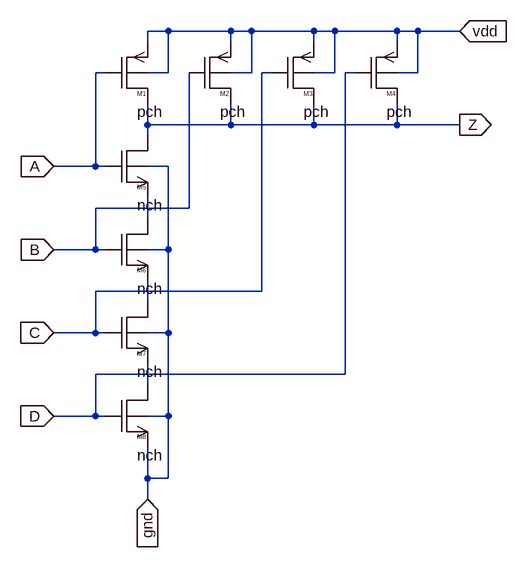
[diagram p0: schematic mynand4.asc]
mynand4.asc, the LTspice schematic file:
Version 4
SHEET 1 880 680
WIRE 128 -240 96 -240
WIRE 224 -240 128 -240
WIRE 256 -240 224 -240
WIRE 352 -240 256 -240
WIRE 384 -240 352 -240
WIRE 480 -240 384 -240
WIRE 512 -240 480 -240
WIRE 576 -240 512 -240
WIRE 96 -224 96 -240
WIRE 224 -224 224 -240
WIRE 352 -224 352 -240
WIRE 480 -224 480 -240
WIRE 32 -176 16 -176
WIRE 128 -176 128 -240
WIRE 128 -176 96 -176
WIRE 256 -176 256 -240
WIRE 256 -176 224 -176
WIRE 288 -176 272 -176
WIRE 384 -176 384 -240
WIRE 384 -176 352 -176
WIRE 416 -176 400 -176
WIRE 512 -176 512 -240
WIRE 512 -176 480 -176
WIRE 96 -96 96 -128
WIRE 224 -96 224 -128
WIRE 224 -96 96 -96
WIRE 352 -96 352 -128
WIRE 352 -96 224 -96
WIRE 480 -96 480 -128
WIRE 480 -96 352 -96
WIRE 576 -96 480 -96
WIRE 96 -80 96 -96
WIRE 16 -32 16 -176
WIRE 16 -32 -48 -32
WIRE 32 -32 16 -32
WIRE 128 -32 96 -32
WIRE 160 32 160 -176
WIRE 160 32 16 32
WIRE 96 48 96 16
WIRE 16 96 16 32
WIRE 16 96 -48 96
WIRE 32 96 16 96
WIRE 128 96 128 -32
WIRE 128 96 96 96
WIRE 272 160 272 -176
WIRE 272 160 16 160
WIRE 96 176 96 144
WIRE 16 224 16 160
WIRE 16 224 -48 224
WIRE 32 224 16 224
WIRE 128 224 128 96
WIRE 128 224 96 224
WIRE 400 288 400 -176
WIRE 400 288 16 288
WIRE 96 304 96 272
WIRE 16 352 16 288
WIRE 16 352 -48 352
WIRE 32 352 16 352
WIRE 128 352 128 224
WIRE 128 352 96 352
WIRE 96 448 96 400
WIRE 128 448 128 352
WIRE 128 448 96 448
WIRE 96 480 96 448
FLAG -48 -32 A
IOPIN -48 -32 In
FLAG -48 96 B
IOPIN -48 96 In
FLAG -48 224 C
IOPIN -48 224 In
FLAG -48 352 D
IOPIN -48 352 In
FLAG 576 -96 Z
IOPIN 576 -96 Out
FLAG 96 480 gnd
IOPIN 96 480 In
FLAG 576 -240 vdd
IOPIN 576 -240 In
SYMBOL pmos4 32 -176 R0
WINDOW 3 48 60 Left 2
SYMATTR InstName M1
SYMATTR Value pch
SYMATTR Value2 l=2u w=18u
SYMBOL pmos4 160 -176 R0
WINDOW 3 48 60 Left 2
SYMATTR InstName M2
SYMATTR Value pch
SYMATTR Value2 l=2u w=18u
SYMBOL pmos4 288 -176 R0
WINDOW 3 48 60 Left 2
SYMATTR InstName M3
SYMATTR Value pch
SYMATTR Value2 l=2u w=18u
SYMBOL pmos4 416 -176 R0
WINDOW 3 48 60 Left 2
SYMATTR InstName M4
SYMATTR Value pch
SYMATTR Value2 l=2u w=18u
SYMBOL nmos4 32 -32 R0
WINDOW 3 48 60 Left 2
SYMATTR InstName M5
SYMATTR Value nch
SYMATTR Value2 l=2u w=6u
SYMBOL nmos4 32 96 R0
WINDOW 3 48 60 Left 2
SYMATTR InstName M6
SYMATTR Value nch
SYMATTR Value2 l=2u w=6u
SYMBOL nmos4 32 224 R0
WINDOW 3 48 60 Left 2
SYMATTR InstName M7
SYMATTR Value nch
SYMATTR Value2 l=2u w=6u
SYMBOL nmos4 32 352 R0
WINDOW 3 48 60 Left 2
SYMATTR InstName M8
SYMATTR Value nch
SYMATTR Value2 l=2u w=6u

The netlist it stands for:
* mynand4.asc
M1 Z A vdd vdd pch l=2u w=18u
M2 Z B vdd vdd pch l=2u w=18u
M3 Z C vdd vdd pch l=2u w=18u
M4 Z D vdd vdd pch l=2u w=18u
M5 Z A N001 gnd nch l=2u w=6u
M6 N001 B N002 gnd nch l=2u w=6u
M7 N002 C N003 gnd nch l=2u w=6u
M8 N003 D gnd gnd nch l=2u w=6u
.model NMOS NMOS
.model PMOS PMOS
.lib standard.mos
.backanno
.end